# EAGLE design 0124-logic-level-shifter (EAGLE 9.6.2)
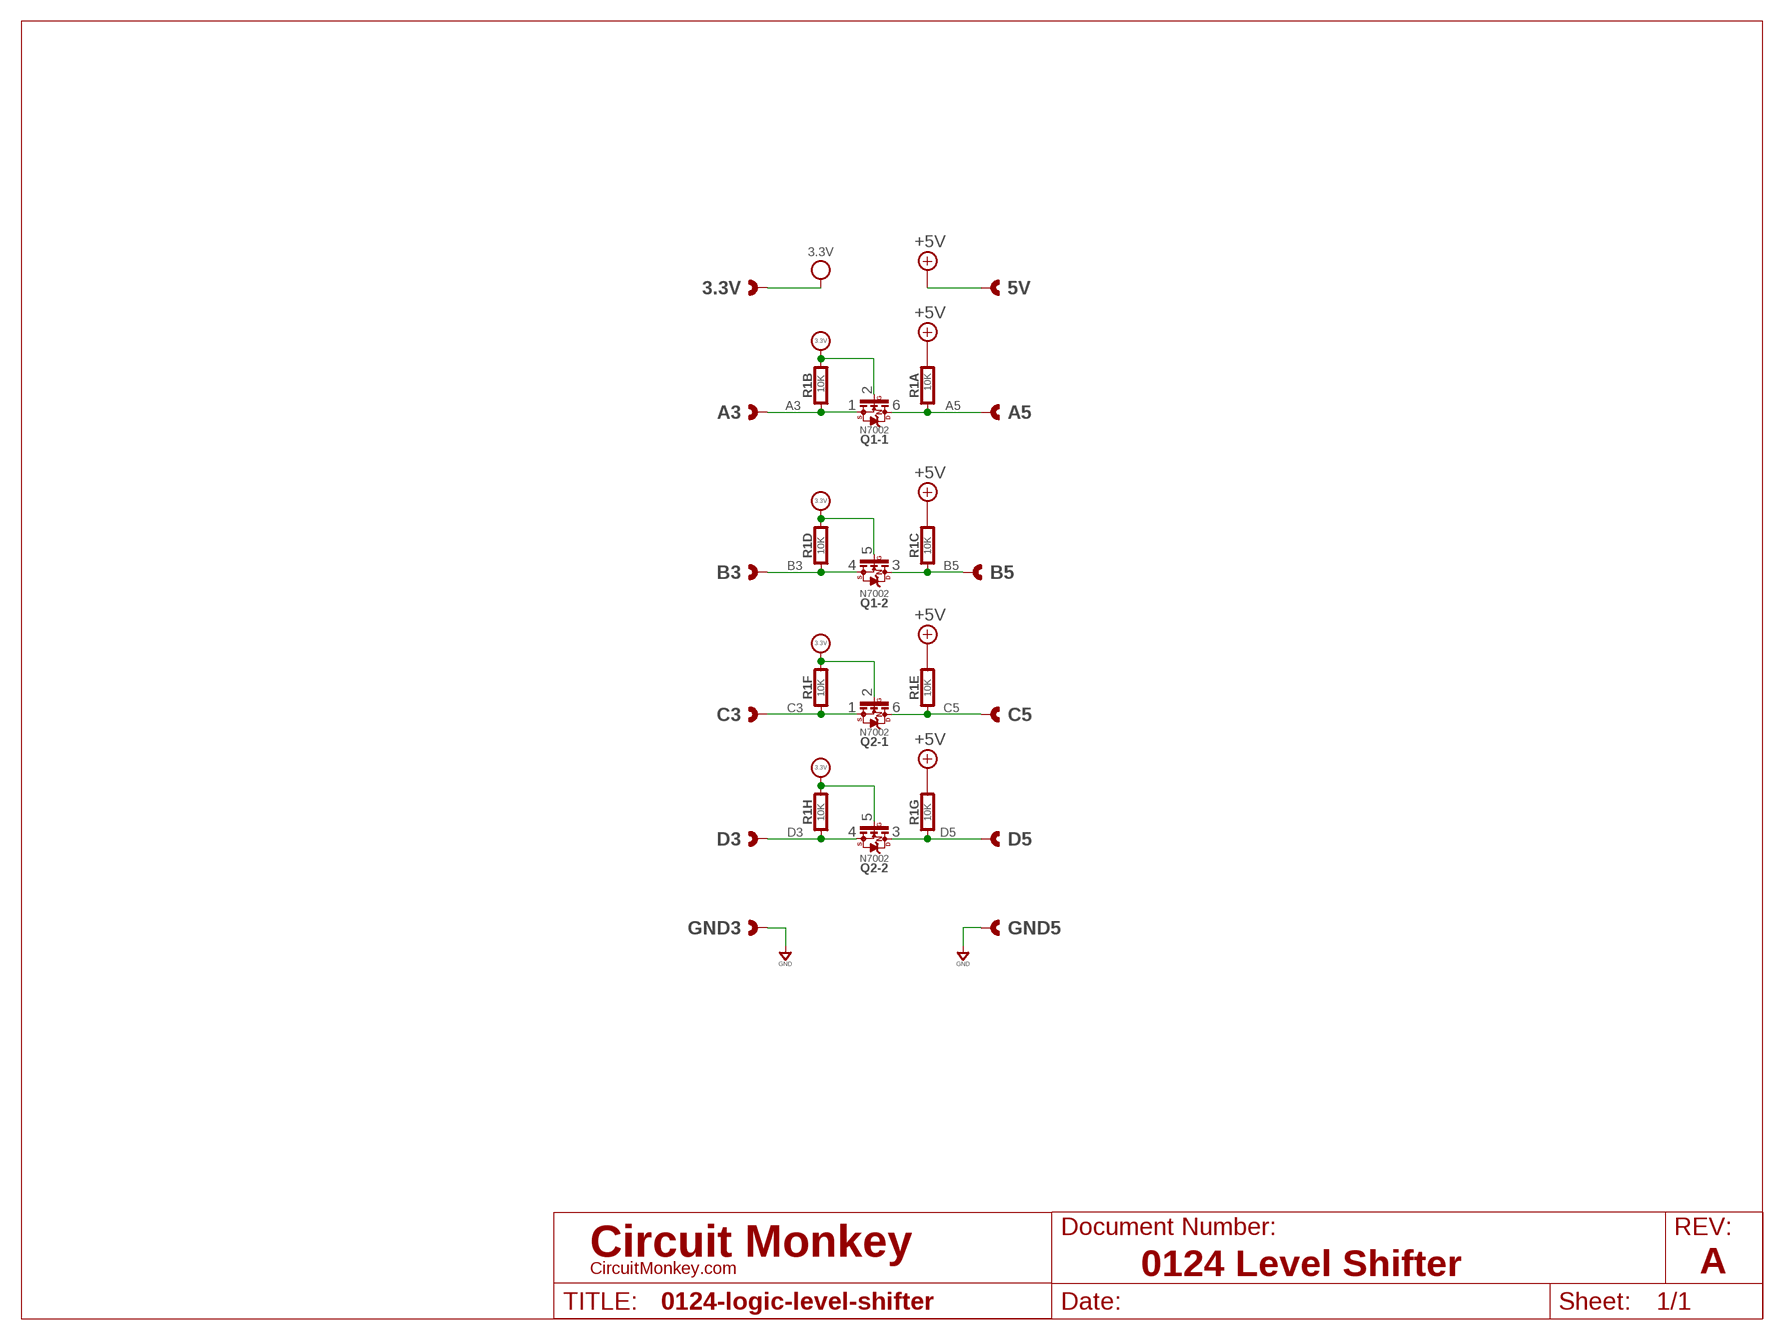
[diagram p0: schematic, sheet 1]
U$1 (LETTER_L-CIRCUITMONKEY): DOCUMENT_NUMBER: 0124 Level Shifter; REV: A

## Parts
3.3V  CAST-01X12.00MM  [CAST01-2.00MM]
5V  CAST-01X12.00MM  [CAST01-2.00MM]
A3  CAST-01X12.00MM  [CAST01-2.00MM]
A5  CAST-01X12.00MM  [CAST01-2.00MM]
B3  CAST-01X12.00MM  [CAST01-2.00MM]
B5  CAST-01X12.00MM  [CAST01-2.00MM]
C3  CAST-01X12.00MM  [CAST01-2.00MM]
C5  CAST-01X12.00MM  [CAST01-2.00MM]
D3  CAST-01X12.00MM  [CAST01-2.00MM]
D5  CAST-01X12.00MM  [CAST01-2.00MM]
GND3  CAST-01X12.00MM  [CAST01-2.00MM]
GND5  CAST-01X12.00MM  [CAST01-2.00MM]
Q1  N7002  N-FET_DUAL7002  [SOT-563]
Q2  N7002  N-FET_DUAL7002  [SOT-563]
R1  10K  RESNET_0402_INDIV_X8PAN  [RESNET_0402_X8]

## Nets
+3.3V: 3.3V.1 3.3V.P$1 3.3V.P$2 Q1.2(-1:G) Q1.5(-2:G) Q2.2(-1:G) Q2.5(-2:G) R1.9 R1.11 R1.13 R1.15 ; supply symbol labelled 3.3V
+5V: 5V.1 5V.P$1 5V.P$2 R1.10 R1.12 R1.14 R1.16
A3: A3.1 A3.P$1 A3.P$2 Q1.1(-1:S) R1.2
A5: A5.1 A5.P$1 A5.P$2 Q1.6(-1:D) R1.1
B3: B3.1 B3.P$1 B3.P$2 Q1.4(-2:S) R1.4
B5: B5.1 B5.P$1 B5.P$2 Q1.3(-2:D) R1.3
C3: C3.1 C3.P$1 C3.P$2 Q2.1(-1:S) R1.6
C5: C5.1 C5.P$1 C5.P$2 Q2.6(-1:D) R1.5
D3: D3.1 D3.P$1 D3.P$2 Q2.4(-2:S) R1.8
D5: D5.1 D5.P$1 D5.P$2 Q2.3(-2:D) R1.7
GND: GND3.1 GND3.P$1 GND3.P$2 GND5.1 GND5.P$1 GND5.P$2

## Library data of the parts
3.3V 5V A3 A5 B3 B5 C3 C5 D3 D5 GND3 GND5 = con-headers:CAST-01X1: Castelated Edge Hole Pad
Q1 Q2 = transistor-fet:N-FET_DUAL: Dual FET; COST01: 0.25; COST100: 0.07; MFR: Toshiba; MPN: SSM6N7002BFE
R1 = rlc:RESNET_0402_INDIV_X8: Resnet - Network Eight Individual Resistors.; COST01: 0.27; COST100: 0.07; MFR: Panasonic'; MPN: EXB2HVxxx

## Board
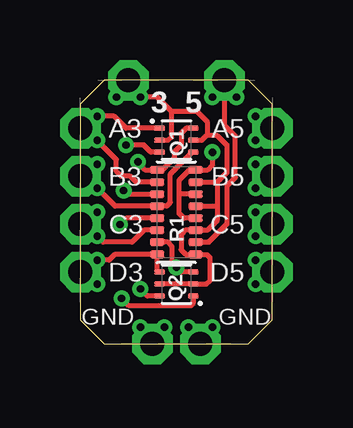
[diagram p1: board, top side]
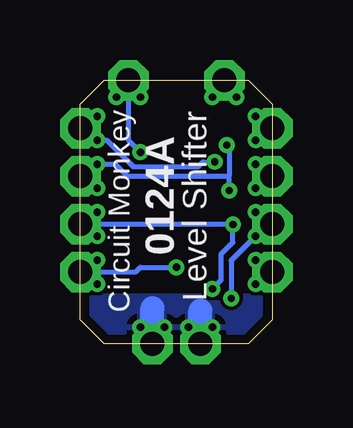
[diagram p2: board, bottom side, seen from below]

Size 8 x 11 mm. Coordinates in mm from the lower left corner, seen from the top.
Outline: 0,10 0,1 1,0 7,0 8,1 8,10 7,11 1,11 0,10
Copper layers (1*16): Top 0.0356mm / dielectric 1.5011mm / Bottom 0.0356mm
Design rules "OSH-CircuitMonkey *": minimum track width 6mil, minimum drill 12mil, track to track 6mil, track to pad 6mil, pad to pad 6mil, via to via 6mil, smd to smd 6mil, copper to edge 15mil, drill to drill 6mil, minimum pad ring 7mil, minimum via ring 7mil, stop-mask expansion 3mil, vias tented up to drill 13mil, thermal gap 10mil

### Footprints (pad centres in the part's own frame; a part is rotated, then mirrored left to right if it is on the bottom)
CAST01-2.00MM = drill 1 pad 1.7 octagon: 1 0,0 | drill 0.305: P$1 -0.7,0.5; P$2 -0.7,-0.5
SOT-563 = smd 0.2 x 0.45: 1 -0.5,-0.7; 2 0,-0.7; 3 0.5,-0.7; 4 0.5,0.7; 5 0,0.7; 6 -0.5,0.7
RESNET_0402_X8 = smd 0.6 x 0.325: 1 -0.8,1.765; 8 -0.8,-1.765; 9 0.8,-1.765; 16 0.8,1.765 | smd 0.6 x 0.3: 2 -0.8,1.25; 3 -0.8,0.75; 4 -0.8,0.25; 5 -0.8,-0.25; 6 -0.8,-0.75; 7 -0.8,-1.25; 10 0.8,-1.25; 11 0.8,-0.75; 12 0.8,-0.25; 13 0.8,0.25; 14 0.8,0.75; 15 0.8,1.25

### Placement (x,y rotation side)
3.3V  2,11 90 top
5V  6,11 90 top
A3  0,9 180 top
A5  8,9 0 top
B3  0,7 180 top
B5  8,7 0 top
C3  0,5 180 top
C5  8,5 0 top
D3  0,3 180 top
D5  8,3 0 top
GND3  3,0 270 top
GND5  5,0 270 top
Q1  4,8.5 270 top
Q2  4,2.5 90 top
R1  4,5.5 0 top

### Tracks (layer width: path | path; a pad name or v marks a point on that pad's centre or on a via)
+3.3V
  Top 0.2: 5.7,6.75 5.7,5.75 | 5.7,5.75 5.7,5.15 5.3,4.75 R1.11 4.38,4.75 4.2,4.57 4.2,3.93 4.39,3.73 R1.9 5.26,3.73 5.4,3.6 5.4,2.65 5.25,2.5 Q2.2 Q2.5 | 5.28,8.7 5.7,8.7 6.1,8.3 6.1,7.15 5.7,6.75 | Q1.5 5.05,8.5 5.25,8.7 5.28,8.7 | Q1.2 3.66,8.5 3.8,8.64 3.8,9.7 | R1.15 5.7,6.75 | R1.13 5.7,5.75 | 5.28,8.7 5.28,9.28 4.86,9.7 3.8,9.7 | 3.8,9.7 3.2,10.3 3.3V.P$2
  Bottom 0.2: 2,10.8 3.3V.P$2 | 3.3V.1 2,10.8 | 2,10.8 3.3V.P$1
+5V  (via drill 0.3)
  Top 0.2: 5V.1 6,9.12 6.45,8.67 6.45,6.95 6.1,6.6 6.1,5 5.35,4.25 R1.10 | 4.11,6.3 4.11,6.83 4.54,7.26 R1.16 5.3,7.26 5.5,7.46 v5.5,8 | 4.11,6.3 4.11,5.46 4.31,5.25 R1.12 | R1.14 4.16,6.25 4.11,6.3
  Bottom 0.2: v5.5,8 6,8.5 5V.1 6,10.8 | 6,10.8 5V.P$2 | 6,10.8 5V.P$1
A3
  Top 0.2: R1.2 2.33,6.75 2.08,7 1.7,7 1.5,7.2 1.5,7.7 0.7,8.48 A3.P$1 | Q1.1 1.9,9 1.4,9.5 A3.P$2
  Bottom 0.2: 0.2,9 A3.P$1 | A3.1 0.2,9 | 0.2,9 A3.P$2
A5  (via drill 0.3)
  Top 0.2: Q1.6 4.4,9 4.2,8.8 4.2,8.3 3.9,8 3.9,7.76 3.4,7.26 R1.1 2.7,7.26 2.4,7.57 v2.4,7.6
  Bottom 0.2: v2.4,7.6 2.9,7.6 3.1,7.4 5.8,7.4 6.9,8.5 A5.P$2 7.8,9 | 7.8,9 A5.P$1 | A5.1 7.8,9
B3
  Top 0.2: Q1.4 4.65,8 3.75,7.1 3.75,5.9 3.6,5.75 R1.4 1.45,5.75 0.2,7 B3.1
  Bottom 0.2: 0.2,7 B3.P$1 | B3.1 0.2,7 | 0.2,7 B3.P$2
B5  (via drill 0.3)
  Top 0.2: v1.8,6.4 1.85,6.4 2,6.25 R1.3 | v1.9,8.3 2.64,8.3 2.94,8 Q1.3
  Bottom 0.2: 1.8,7 6.05,7 6.55,7.5 B5.P$1 7.8,7 | v1.8,6.4 1.8,7 | 1.8,7 1.8,8 1.9,8.1 v1.9,8.3 | 7.8,7 B5.P$2 | B5.1 7.8,7
C3  (via drill 0.3)
  Top 0.2: R1.6 2.65,4.75 2.15,4.25 0.95,4.25 0.2,5 C3.1 | Q2.1 4.7,1.7 4.6,1.6 2.02,1.6 v1.72,1.9
  Bottom 0.2: v1.72,1.9 1.72,3.48 C3.P$1 0.68,4.52 0.6,4.52 0.12,5 C3.1 0.2,5 C3.P$2
C5  (via drill 0.3)
  Top 0.2: R1.5 1.91,5.25 v1.64,4.98 | Q2.6 2.79,2 v2.5,2.29 v2.5,2.3
  Bottom 0.2: v2.5,2.3 2.14,2.66 2.14,3.73 1.64,4.23 v1.64,4.98 1.66,5 C5.1 7.8,5 | 7.8,5 C5.P$1 | 7.8,5 C5.P$2
D3
  Top 0.2: D3.P$2 1.2,3.5 1.44,3.73 R1.8 3.2,3.1 Q2.4
  Bottom 0.2: 0.2,3 D3.P$1 | D3.1 0.2,3 | 0.2,3 D3.P$2
D5  (via drill 0.3)
  Top 0.2: R1.7 3.65,4.25 3.8,4.1 3.8,3.4 v4,3.2 4.2,3 Q2.3
  Bottom 0.2: v4,3.2 5.5,3.2 5.7,3 D5.1 7.8,3 | 7.8,3 D5.P$1 | 7.8,3 D5.P$2
GND
  Bottom 0.2: 3,0.2 GND3.P$1 | GND3.1 3,0.2 | 3,0.2 GND3.P$2 | 5,0.2 GND5.P$1 | GND5.1 5,0.2 | 5,0.2 GND5.P$2
  Bottom 1: GND5.1 5,1.5 | GND3.1 3,1.4
  pour Bottom: 0,0 8,0 8,2 0,2

### Text on the board
tPlace: 3 5 | GND | GND
bPlace: Level Shifter | 0124A | Circuit Monkey